# Altium schematic sheet SENSOR_SCH.SchDoc
size A
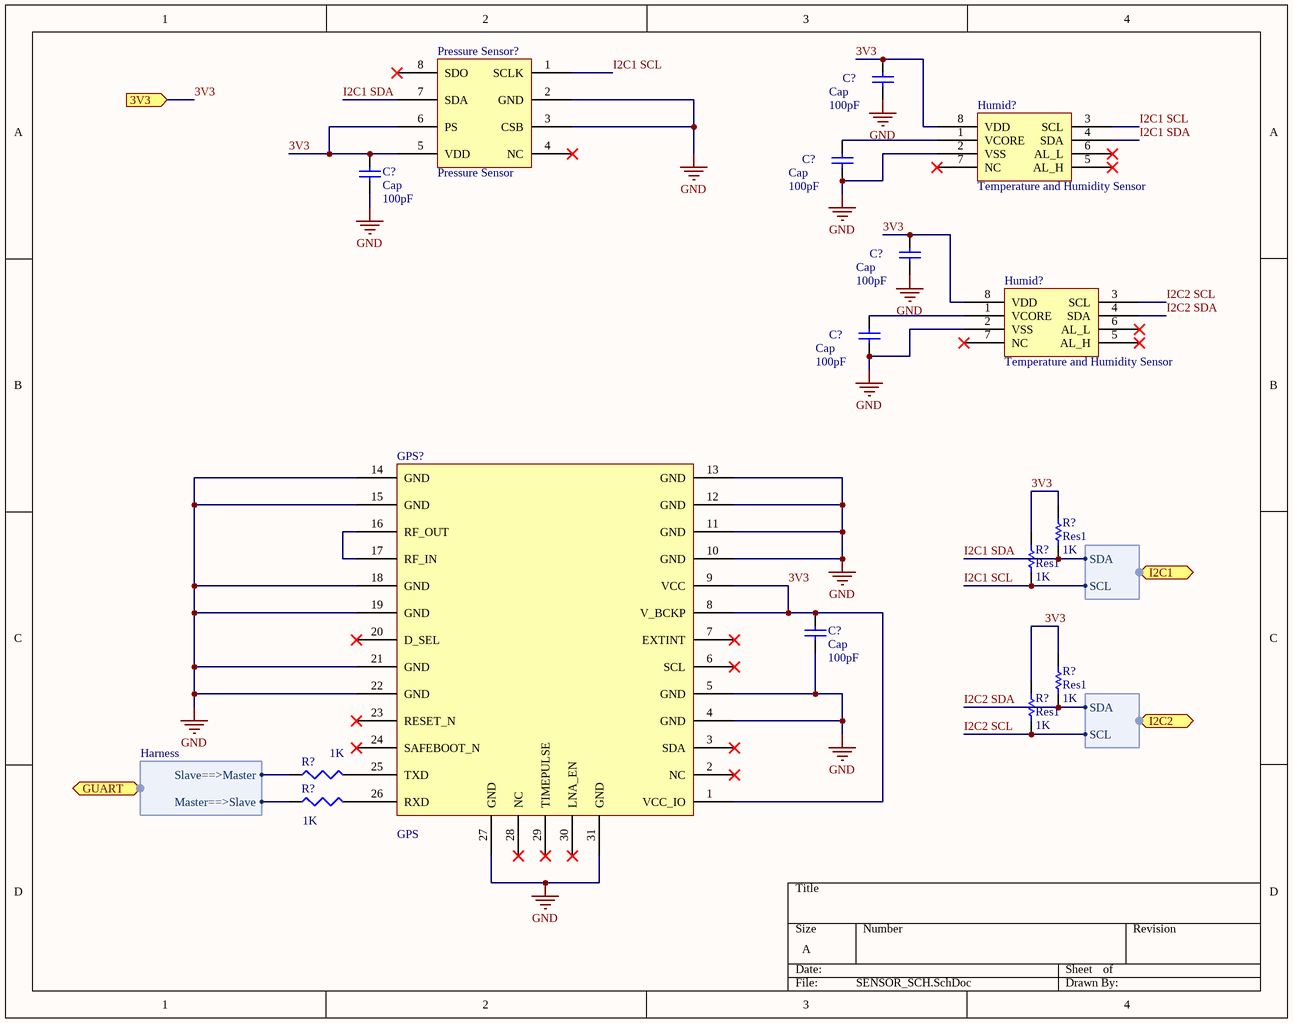
[diagram p0: SENSOR_SCH.SchDoc]

## Parts
(Parts that share a designator on the sheet are numbered #1, #2 ... from top to bottom, then left to right.)
C?#1  Cap  value 100pF  [RAD-0.3]
C?#2  Cap  value 100pF  [RAD-0.3]
C?#3  Cap  value 100pF  [RAD-0.3]
C?#4  Cap  value 100pF  [RAD-0.3]
C?#5  Cap  value 100pF  [RAD-0.3]
C?#6  Cap  value 100pF  [RAD-0.3]
GPS?  GPS
Humid?#1  Temperature and Humidity Sensor
Humid?#2  Temperature and Humidity Sensor
Pressure_Sensor?  Pressure Sensor
R?#1  Res1  value 1K  [AXIAL-0.3]
R?#2  Res1  value 1K  [AXIAL-0.3]
R?#3  Res1  value 1K  [AXIAL-0.3]
R?#4  Res1  value 1K  [AXIAL-0.3]
R?#5  value 1K  [J1-0603]  (hidden comment: Res3)
R?#6  value 1K  [J1-0603]  (hidden comment: Res3)

## Ports
3V3 (in), GUART (harness Harness), I2C1 (harness I2C), I2C2 (harness I2C)

## Harnesses
Harness: Slave==>Master, Master==>Slave
I2C: SDA, SCL

## Nets
GND: C?#1.1 C?#2.1 C?#3.1 C?#4.1 C?#5.1 C?#6.1 GPS?.4(GND) GPS?.5(GND) GPS?.10(GND) GPS?.11(GND) GPS?.12(GND) GPS?.13(GND) GPS?.14(GND) GPS?.15(GND) GPS?.18(GND) GPS?.19(GND) GPS?.21(GND) GPS?.22(GND) GPS?.27(GND) GPS?.31(GND) Humid?#1.2(VSS) Humid?#2.2(VSS) Pressure_Sensor?.2(GND) Pressure_Sensor?.3(CSB)
3V3: C?#1.2 C?#3.2 C?#4.2 C?#6.2 GPS?.1(VCC_IO) GPS?.8(V_BCKP) GPS?.9(VCC) Humid?#1.8(VDD) Humid?#2.8(VDD) Pressure_Sensor?.5(VDD) Pressure_Sensor?.6(PS) R?#1.2 R?#2.2 R?#3.2 R?#4.2 ; port 3V3
I2C1 SCL: Humid?#1.3(SCL) Pressure_Sensor?.1(SCLK) R?#2.1 ; port I2C1.SCL
I2C1 SDA: Humid?#1.4(SDA) Pressure_Sensor?.7(SDA) R?#1.1 ; port I2C1.SDA
I2C2 SCL: Humid?#2.3(SCL) R?#4.1 ; port I2C2.SCL
I2C2 SDA: Humid?#2.4(SDA) R?#3.1 ; port I2C2.SDA
NetC?#2_2: C?#2.2 Humid?#1.1(VCORE)
NetC?#5_2: C?#5.2 Humid?#2.1(VCORE)
NetGPS?_16: GPS?.16(RF_OUT) GPS?.17(RF_IN)
NetGPS?_25: GPS?.25(TXD) R?#5.2
NetGPS?_26: GPS?.26(RXD) R?#6.2
NetR?#5_1: R?#5.1 ; port GUART.Slave==>Master
NetR?#6_1: R?#6.1 ; port GUART.Master==>Slave

Not connected (* = marked no-connect by the designer): GPS? 2(NC)* 3(SDA)* 6(SCL)* 7(EXTINT)* 20(D_SEL)* 23(RESET_N)* 24(SAFEBOOT_N)* 28(NC)* 29(TIMEPULSE)* 30(LNA_EN)*; Humid?#1 5(AL_H)* 6(AL_L)* 7(NC)*; Humid?#2 5(AL_H)* 6(AL_L)* 7(NC)*; Pressure_Sensor? 4(NC)* 8(SDO)*

## Library data of the parts
C?#1-C?#6 = Cap: Capacitor; Published: 8-Jun-2000; LatestRevisionDate: 17-Jul-2002; LatestRevisionNote: Re-released for DXP Platform.; PackageReference: RAD-0.3; Publisher: Altium Limited; PackageDescription: Radial Cap, Thru-Hole; 2 Leads; 0.3 in Pin Spacing
GPS? = GPS: CAM M8C
Humid?#1 Humid?#2 = Temperature and Humidity Sensor: HIH6030-021-001
Pressure_Sensor? = Pressure Sensor: MS580301BA01-00
R?#1-R?#4 = Res1: Resistor; Published: 8-Jun-2000; LatestRevisionDate: 17-Jul-2002; LatestRevisionNote: Re-released for DXP Platform.; PackageReference: AXIAL-0.3; Publisher: Altium Limited; PackageDescription: Axial Device, Thru-Hole; 2 Leads; 0.3 in Pin Spacing
R?#5 R?#6 = Res3: Resistor; Published: 8-Jun-2000; LatestRevisionDate: 29-May-2009; LatestRevisionNote: IPC-7351 Footprint Added.; PackageReference: J1-0603; Publisher: Altium Limited; PackageDescription: Chip Resistor